# Altium project 243-TGE-Lab1_PCB1_Capteurs.PrjPcb
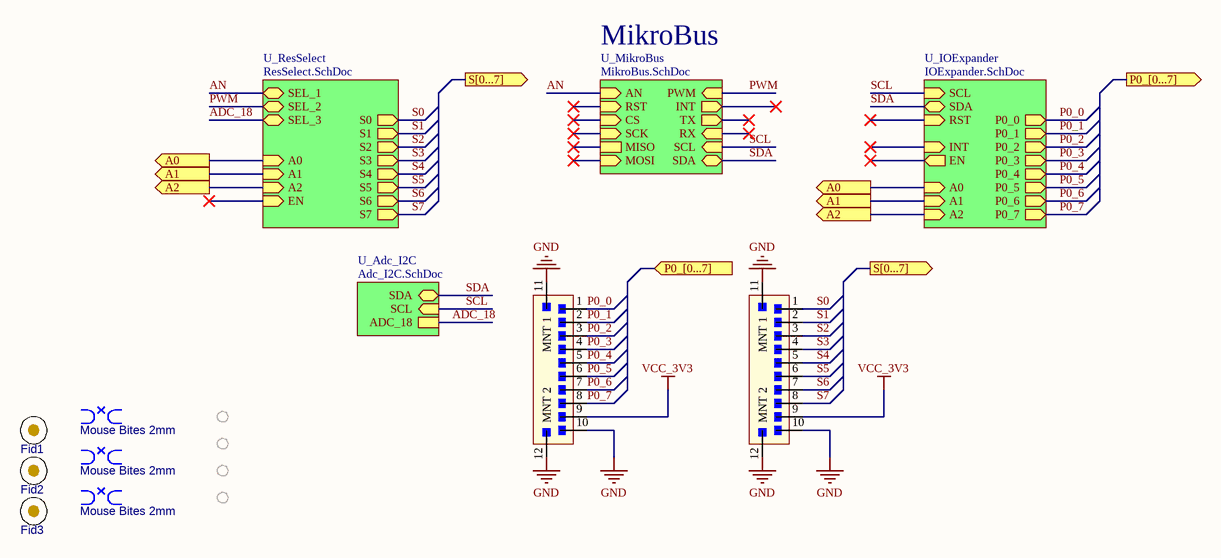
[diagram p0: HeadSheet.SchDoc]
NomDeLetudiant: Le nom de l'étudiant; NomDeProjet: Le nom de mon Projet; Revision: La Revision
5 sheets, 49 parts. Net scope: hierarchical (ports join the sheet entries above them; power ports are global).
Board file: Pcb1.PcbDoc
Sheets:
  HeadSheet.SchDoc
    U_MikroBus = MikroBus.SchDoc
    U_Adc_I2C = Adc_I2C.SchDoc
    U_IOExpander = IOExpander.SchDoc
    U_ResSelect = ResSelect.SchDoc

## Sheet HeadSheet.SchDoc
size Letter; SheetNumber: 1; SheetTotal: 5

### Parts
BRK1  value Mouse Bites 2mm  [BK_CRACK1B_M]  (hidden comment: DNP)  (no BOM)
BRK2  value Mouse Bites 2mm  [BK_CRACK1B_M]  (hidden comment: DNP)  (no BOM)
BRK3  value Mouse Bites 2mm  [BK_CRACK1B_M]  (hidden comment: DNP)  (no BOM)
Fid1  DNP  [FD_Fiducial]  (value not drawn)  (no BOM)
Fid2  DNP  [FD_Fiducial]  (value not drawn)  (no BOM)
Fid3  DNP  [FD_Fiducial]  (value not drawn)  (no BOM)
J1  HC-ZH-10PWT  [J_S10B-ZR-SM4]  (value not drawn)
J2  HC-ZH-10PWT  [J_S10B-ZR-SM4]  (value not drawn)
MH1  DNP  [MP_M-Hole_M2-NonPlated]  (value not drawn)  (no BOM)
MH2  DNP  [MP_M-Hole_M2-NonPlated]  (value not drawn)  (no BOM)
MH3  DNP  [MP_M-Hole_M2-NonPlated]  (value not drawn)  (no BOM)
MH4  DNP  [MP_M-Hole_M2-NonPlated]  (value not drawn)  (no BOM)

### Sub-sheets
U_Adc_I2C = Adc_I2C.SchDoc: ADC_18, SCL (in), SDA (bidir)
U_IOExpander = IOExpander.SchDoc: SCL (in), SDA (bidir), RST (in), P0_0 (out), P0_1 (out), P0_2 (out), P0_3 (out), P0_4 (out), P0_5 (out), P0_6 (out), P0_7 (out), EN (out), INT (in), A0 (in), A1 (in), A2 (in)
U_MikroBus = MikroBus.SchDoc: SDA (bidir), SCL (in), RX (in), TX (out), INT (out), PWM (in), MOSI (in), MISO, SCK (in), CS (in), RST (in), AN (in)
U_ResSelect = ResSelect.SchDoc: EN (in), S0 (out), S1 (out), S2 (out), S3 (out), S4 (out), S5 (out), S6 (out), S7 (out), SEL_1 (bidir), SEL_2 (bidir), SEL_3 (bidir), A0 (in), A1 (in), A2 (in)

### Ports
A0 (out), A1 (out), A2 (out), P0_[0...7] (in), P0_[0...7] (out), S[0...7] (out)

### Nets
GND: J1.10 J1.11(MNT_1) J1.12(MNT_2) J2.10 J2.11(MNT_1) J2.12(MNT_2)
VCC_3V3: J1.9 J2.9
A0: port A0, sheet U_IOExpander/A0, sheet U_ResSelect/A0
A1: port A1, sheet U_IOExpander/A1, sheet U_ResSelect/A1
A2: port A2, sheet U_IOExpander/A2, sheet U_ResSelect/A2
ADC_18: sheet U_Adc_I2C/ADC_18, sheet U_ResSelect/SEL_3
AN: sheet U_MikroBus/AN, sheet U_ResSelect/SEL_1
P0_0: J1.1 ; sheet U_IOExpander/P0_0
P0_1: J1.2 ; sheet U_IOExpander/P0_1
P0_2: J1.3 ; sheet U_IOExpander/P0_2
P0_3: J1.4 ; sheet U_IOExpander/P0_3
P0_4: J1.5 ; sheet U_IOExpander/P0_4
P0_5: J1.6 ; sheet U_IOExpander/P0_5
P0_6: J1.7 ; sheet U_IOExpander/P0_6
P0_7: J1.8 ; sheet U_IOExpander/P0_7
PWM: sheet U_MikroBus/PWM, sheet U_ResSelect/SEL_2
S0: J2.1 ; sheet U_ResSelect/S0
S1: J2.2 ; sheet U_ResSelect/S1
S2: J2.3 ; sheet U_ResSelect/S2
S3: J2.4 ; sheet U_ResSelect/S3
S4: J2.5 ; sheet U_ResSelect/S4
S5: J2.6 ; sheet U_ResSelect/S5
S6: J2.7 ; sheet U_ResSelect/S6
S7: J2.8 ; sheet U_ResSelect/S7
SCL: sheet U_MikroBus/SCL, sheet U_Adc_I2C/SCL, sheet U_IOExpander/SCL
SDA: sheet U_MikroBus/SDA, sheet U_Adc_I2C/SDA, sheet U_IOExpander/SDA

Not connected (* = marked no-connect by the designer): BRK1 1 2 3 4 5; BRK2 1 2 3 4 5; BRK3 1 2 3 4 5; Fid1 1 2 3 4 5; Fid2 1 2 3 4 5; Fid3 1 2 3 4 5

### Notes on the sheet
- MikroBus
- Titre :
- Conception :
- Date :
- Approbation :
- Heure :
- Révision :
- Feuille
- de
- Fichier :

### Library data of the parts
BRK1-BRK3 = BK_BREAKOUT_2MM: Mouse Bites; Mounting Technology: N/A
Fid1-Fid3 = Fiducial: Fiducial mark for alignement and Pick&Place; Value: Fiducial mark; Mounting Technology: N/A
J1 J2 = CONN-1MM5-01X10-S10B-H-SMT: CONN wire to board SMT R/A 10POS 1.5mm; Manufacturer 1: HCTL; Manufacturer Part Number 1: HC-ZH-10PWT; Manufacturer 2: JST; Manufacturer Part Number 2: S10B-ZR-SM4A-TF(LF)(SN); Mounting Technology: SMT; Supplier 1: LCSC; Supplier 2: LCSC; Supplier Part Number 1: C2845432; Supplier Part Number 2: C5149249; Supplier 3: Digikey; Supplier Part Number 3: 455-1700-1-ND
MH1-MH4 = MH-2MM_NP: Mounting Hole 2mm non plated; Manufacturer Part Number 1: DNP; Mounting Technology: N/A; Value: Mounting Hole 2mm non plated; Supplier Part Number 1: N/A

## Sheet MikroBus.SchDoc: Connecteur MikroBus
size Letter; ApprovedBy: Kevin Cotton; Author: Ing. Di Stefano; Organization: Cegep Limoilou; Address1: 1300, 8e Avenue; Address2: Québec, QC; Address3: Canada; Address4: G1J 5L5; Revision: A; SheetNumber: 3; SheetTotal: 5
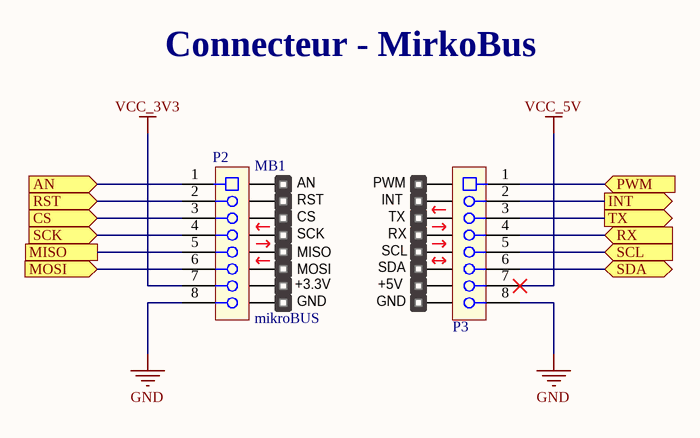
[diagram p1: MikroBus.SchDoc]

### Parts
MB1  mikroBUS  [mikroBUS-Large-No-Connector]  (no BOM)
P2  ESQ-108-14-T-S  [CONN_SKT_01X08_100MIL-ELEVATED-LONGPIN]  (value not drawn)
P3  ESQ-108-14-T-S  [CONN_SKT_01X08_100MIL-ELEVATED-LONGPIN]  (value not drawn)

### Ports
AN (in), CS (in), INT (out), MISO, MOSI (in), PWM (in), RST (in), RX (in), SCK (in), SCL (in), SDA (bidir), TX (out)

### Nets
GND: P2.8 P3.8
VCC_3V3: P2.7
VCC_5V: P3.7
AN: P2.1 ; port AN
CS: P2.3 ; port CS
INT: P3.2 ; port INT
MISO: P2.5 ; port MISO
MOSI: P2.6 ; port MOSI
PWM: P3.1 ; port PWM
RST: P2.2 ; port RST
RX: P3.4 ; port RX
SCK: P2.4 ; port SCK
SCL: P3.5 ; port SCL
SDA: P3.6 ; port SDA
TX: P3.3 ; port TX

Not connected (* = marked no-connect by the designer): MB1 1(AN) 2(RST) 3(CS) 4(SCK) 5(MISO) 6(MOSI) 7(3.3V) 8(GND) 9(GND) 10(5V) 11(SDA) 12(SCL) 13(TX) 14(RX) 15(INT) 16(PWM)

### Notes on the sheet
- Connecteur - MirkoBus
- Titre :
- Conception :
- Date :
- Approbation :
- Heure :
- Révision :
- Feuille
- de
- Fichier :
- (in symbol mikroBUS compatible add-on board) +3.3V; +5V

### Library data of the parts
MB1 = mikroBUS compatible add-on board
P2 P3 = CONN-100MIL-SKT-01X08_ELEVATED_LONGPIN: CONN SOCKET 8pos 100mils Elevated; Manufacturer 1: Samtec; Mounting Technology: TH; Manufacturer Part Number 1: ESQ-108-14-T-S; Supplier 1: Digikey; Supplier Part Number 1: SAM9303-ND

## Sheet Adc_I2C.SchDoc: Circuit ADC I2C
size Letter; ApprovedBy: Kevin Cotton; Author: Ing. Di Stefano; Organization: Cegep Limoilou; Address1: 1300, 8e Avenue; Address2: Québec, QC; Address3: Canada; Address4: G1J 5L5; Revision: A; SheetNumber: 2; SheetTotal: 5
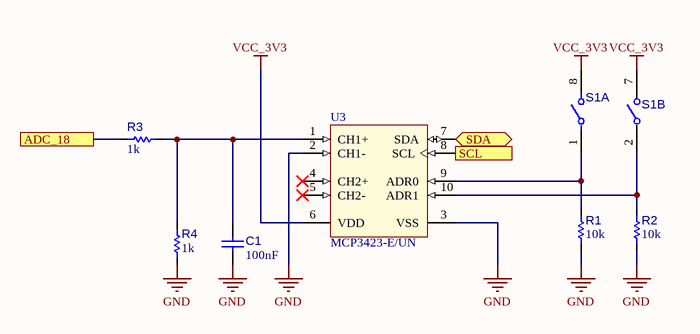
[diagram p2: Adc_I2C.SchDoc]

### Parts
C1  value 100nF  [C_1608[0603]]  (hidden comment: CAP CER 100nF 50V 0603)
R1  value 10k  [R_1608[0603]]  (hidden comment: Res 10k 1% 0603)
R2  value 10k  [R_1608[0603]]  (hidden comment: Res 10k 1% 0603)
R3  value 1k  [R_1608[0603]]  (hidden comment: Res 1k 1% 0603)
R4  value 1k  [R_1608[0603]]  (hidden comment: Res 1k 1% 0603)
S1  DSHP04TSGER  [S_DIP_SWITCH_50MIL_4POS]  (value not drawn)  (parts A,B of 4)
U3  MCP3423-E/UN  [U_MSOP50P300X500-10(RM-10)_WO-TP]

### Ports
ADC_18, SCL (in), SDA (bidir)

### Nets
GND: C1.1 R1.1 R2.1 R4.1 U3.2(CH1-) U3.3(VSS)
VCC_3V3: S1.7 S1.8 U3.6(VDD)
ADC_18: R3.1 ; port ADC_18
SCL: U3.8(SCL) ; port SCL
SDA: U3.7(SDA) ; port SDA
NetC1_2: C1.2 R3.2 R4.2 U3.1(CH1+)
NetR1_2: R1.2 S1.1 U3.9(ADR0)
NetR2_2: R2.2 S1.2 U3.10(ADR1)

Not connected (* = marked no-connect by the designer): U3 4(CH2+)* 5(CH2-)*

### Notes on the sheet
- Titre :
- Conception :
- Date :
- Approbation :
- Heure :
- Révision :
- Feuille
- de
- Fichier :

### Library data of the parts
C1 = CAP002: Capacitor type 1; Manufacturer 1: Yageo; Manufacturer Part Number 1: CC0603KRX7R9BB104; LibRef: CAP002; Code CEGEP: COND0143SM; Tolerance: 10%; Dielectric: X7R; Rated Voltage: 50V; Mounting Technology: SMT; Supplier 1: LCSC; Supplier Part Number 1: C14663
R1 R2 = RES001: Resistor type 1; Manufacturer 1: Yageo; Manufacturer Part Number 1: RC0603FR-0710KL; LibRef: RES001; Code CEGEP: RESI0238-0603; Puissance: 1/10W; Max Working Voltage: 75V; Tolerance: 1%; Mounting Technology: SMT; Supplier 1: LCSC; Supplier Part Number 1: C98220
R3 R4 = RES015: Resistor type 1; Manufacturer 1: Yageo; Manufacturer Part Number 1: RC0603FR-071KL; LibRef: RES015; Puissance: 1/10W; Max Working Voltage: 75V; Tolerance: 1%; Mounting Technology: SMT; Supplier 1: LCSC; Supplier Part Number 1: C22548
S1 = SW_DIP_50MIL_4POS: SWITCH DIP SLIDE SPST 25MA 24V, pitch 1.27mm, height 1.55mm; Manufacturer 1: kangshen; Value: DIP Switch 4pos; Manufacturer 2: Omron; Manufacturer Part Number 1: DSHP04TSGER; Manufacturer Part Number 2: A6H-4102-PM; Mounting Technology: SMT; Supplier 1: LCSC; Supplier 2: LCSC; Supplier Part Number 1: C3293144; Supplier Part Number 2: C2733274; Supplier 3: Digikey; Supplier Part Number 3: 39-A6H-4102-PMCT-ND
U3 = U_MCP3423-E/UN: CAN Controller Stand-Alone With SPI, 18-Pin PDIP; Manufacturer 1: Microchip; Manufacturer Part Number 1: MCP3423-E/UN; Supplier 1: LCSC; Supplier Part Number 1: C220864; Mounting Technology: SMT; Supplier 2: Digikey; Supplier Part Number 2: MCP3423-E/UN-ND

## Sheet IOExpander.SchDoc: I/O Expander
size Letter; ApprovedBy: Kevin Cotton; Author: Jessica Di Stefano; Organization: Cegep Limoilou; Address1: 1300, 8e Avenue; Address2: Québec, QC; Address3: Canada; Address4: G1J 5L5; SheetNumber: 5; SheetTotal: 5
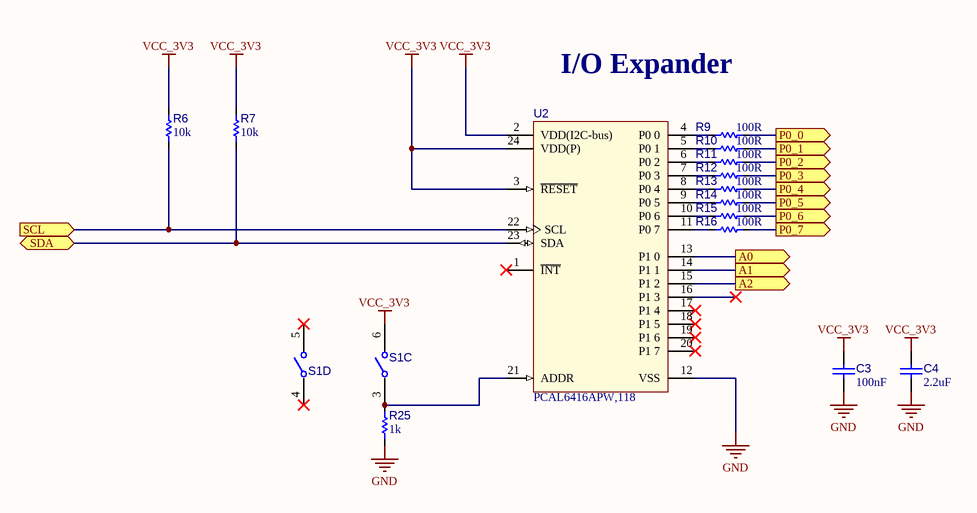
[diagram p3: IOExpander.SchDoc]

### Parts
C3  value 100nF  [C_1608[0603]]  (hidden comment: CAP CER 100nF 50V 0603)
C4  value 2.2uF  [C_1608[0603]]  (hidden comment: CAP CER 2.2uF 10V X7R 0603)
R6  value 10k  [R_1608[0603]]  (hidden comment: Res 10k 1% 0603)
R7  value 10k  [R_1608[0603]]  (hidden comment: Res 10k 1% 0603)
R9  value 100R  [R_1608[0603]]  (hidden comment: Res 100R 1% 0603)
R10  value 100R  [R_1608[0603]]  (hidden comment: Res 100R 1% 0603)
R11  value 100R  [R_1608[0603]]  (hidden comment: Res 100R 1% 0603)
R12  value 100R  [R_1608[0603]]  (hidden comment: Res 100R 1% 0603)
R13  value 100R  [R_1608[0603]]  (hidden comment: Res 100R 1% 0603)
R14  value 100R  [R_1608[0603]]  (hidden comment: Res 100R 1% 0603)
R15  value 100R  [R_1608[0603]]  (hidden comment: Res 100R 1% 0603)
R16  value 100R  [R_1608[0603]]  (hidden comment: Res 100R 1% 0603)
R25  value 1k  [R_1608[0603]]  (hidden comment: Res 1k 1% 0603)
S1  DSHP04TSGER  [S_DIP_SWITCH_50MIL_4POS]  (value not drawn)  (parts C,D of 4)
U2  PCAL6416APW,118  [U_TSSOP24_SOT355-1-IPC_B]

### Ports
A0 (out), A1 (out), A2 (out), P0_0 (out), P0_1 (out), P0_2 (out), P0_3 (out), P0_4 (out), P0_5 (out), P0_6 (out), P0_7 (out), SCL (in), SDA (bidir)

### Nets
GND: C3.1 C4.1 R25.1 U2.12(VSS)
VCC_3V3: C3.2 C4.2 R6.2 R7.2 S1.6 U2.2(VDD(I2C-bus)) U2.3(~{RESET}) U2.24(VDD(P))
A0: U2.13(P1_0) ; port A0
A1: U2.14(P1_1) ; port A1
A2: U2.15(P1_2) ; port A2
P0_0: R9.2 ; port P0_0
P0_1: R10.2 ; port P0_1
P0_2: R11.2 ; port P0_2
P0_3: R12.2 ; port P0_3
P0_4: R13.2 ; port P0_4
P0_5: R14.2 ; port P0_5
P0_6: R15.2 ; port P0_6
P0_7: R16.2 ; port P0_7
SCL: R6.1 U2.22(SCL) ; port SCL
SDA: R7.1 U2.23(SDA) ; port SDA
NetR9_1: R9.1 U2.4(P0_0)
NetR10_1: R10.1 U2.5(P0_1)
NetR11_1: R11.1 U2.6(P0_2)
NetR12_1: R12.1 U2.7(P0_3)
NetR13_1: R13.1 U2.8(P0_4)
NetR14_1: R14.1 U2.9(P0_5)
NetR15_1: R15.1 U2.10(P0_6)
NetR16_1: R16.1 U2.11(P0_7)
NetR25_2: R25.2 S1.3 U2.21(ADDR)

Not connected (* = marked no-connect by the designer): S1 4* 5*; U2 1(~{INT})* 16(P1_3)* 17(P1_4)* 18(P1_5)* 19(P1_6)* 20(P1_7)*

### Notes on the sheet
- I/O Expander
- Titre :
- Conception :
- Date :
- Approbation :
- Heure :
- Révision :
- Feuille
- de
- Fichier :

### Library data of the parts
C3 = CAP002: as C1 on sheet Adc_I2C; Rated Voltage: 50V; Mounting Technology: SMT; Supplier 1: LCSC; Supplier Part Number 1: C14663
C4 = CAP022: Capacitor type 1; Manufacturer 1: Samsung; Manufacturer Part Number 1: CL10B225KP8NNNC; LibRef: CAP022; Tolerance: 10%; Rated Voltage: 10V; Dielectric: X7R; Mounting Technology: SMT; Supplier 1: LCSC; Supplier Part Number 1: C100082
R6 R7 = RES001: as R1 on sheet Adc_I2C; Tolerance: 1%; Mounting Technology: SMT; Supplier 1: LCSC; Supplier Part Number 1: C98220
R9-R16 = RES029: Resistor type 1; Manufacturer 1: Yageo; Manufacturer Part Number 1: RC0603FR-07100RL; LibRef: RES029; Puissance: 1/10W; Max Working Voltage: 75V; Tolerance: 1%; Mounting Technology: SMT; Supplier 1: LCSC; Supplier Part Number 1: C105588
R25 = RES015: as R3 on sheet Adc_I2C; Tolerance: 1%; Mounting Technology: SMT; Supplier 1: LCSC; Supplier Part Number 1: C22548
S1 = SW_DIP_50MIL_4POS: as S1 on sheet Adc_I2C; Manufacturer 2: Omron; Manufacturer Part Number 1: DSHP04TSGER; Manufacturer Part Number 2: A6H-4102-PM; Mounting Technology: SMT; Supplier 1: LCSC; Supplier 2: LCSC; Supplier Part Number 1: C3293144; Supplier Part Number 2: C2733274; Supplier 3: Digikey; Supplier Part Number 3: 39-A6H-4102-PMCT-ND
U2 = U_PCAL6416APW: IC I/O EXPANDER 16BIT 24TSSOP; Manufacturer Part Number 1: TCA6416APWR; Manufacturer 1: Texas Instruments; Manufacturer 2: NXP Semiconductors; Manufacturer Part Number 2: PCAL6416APW,118; Mounting Technology: SMT; Supplier 1: LCSC; Supplier 2: LCSC; Supplier 3: Digikey; Supplier Part Number 1: C130203; Supplier Part Number 2: C2652299; Supplier Part Number 3: 568-9922-1-ND

## Sheet ResSelect.SchDoc: TITRE
size Letter; ApprovedBy: APPROUVÉ PAR; Author: Le nom de l'étudiant; Organization: Cegep Limoilou; Address1: 1300, 8e Avenue; Address2: Québec, QC; Address3: Canada; Address4: G1J 5L5; SheetNumber: 4; SheetTotal: 5
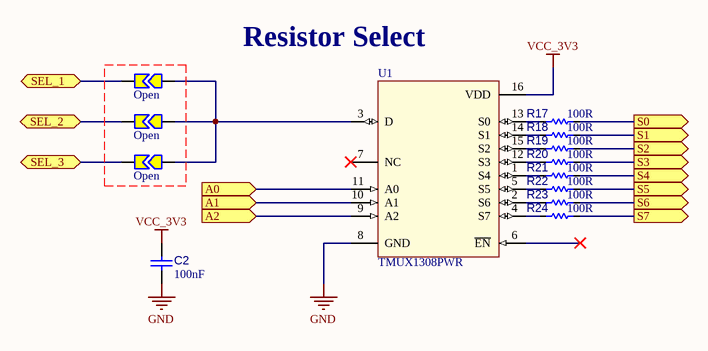
[diagram p4: ResSelect.SchDoc]

### Parts
C2  value 100nF  [C_1608[0603]]  (hidden comment: CAP CER 100nF 50V 0603)
R17  value 100R  [R_1608[0603]]  (hidden comment: Res 100R 1% 0603)
R18  value 100R  [R_1608[0603]]  (hidden comment: Res 100R 1% 0603)
R19  value 100R  [R_1608[0603]]  (hidden comment: Res 100R 1% 0603)
R20  value 100R  [R_1608[0603]]  (hidden comment: Res 100R 1% 0603)
R21  value 100R  [R_1608[0603]]  (hidden comment: Res 100R 1% 0603)
R22  value 100R  [R_1608[0603]]  (hidden comment: Res 100R 1% 0603)
R23  value 100R  [R_1608[0603]]  (hidden comment: Res 100R 1% 0603)
R24  value 100R  [R_1608[0603]]  (hidden comment: Res 100R 1% 0603)
SB1  Open  [SB-TINY-OPEN]  (no BOM)
SB2  Open  [SB-TINY-OPEN]  (no BOM)
SB3  Open  [SB-TINY-OPEN]  (no BOM)
U1  TMUX1308PWR  [U_TSSOP65P500X450-16]

### Ports
A0 (in), A1 (in), A2 (in), S0 (out), S1 (out), S2 (out), S3 (out), S4 (out), S5 (out), S6 (out), S7 (out), SEL_1 (bidir), SEL_2 (bidir), SEL_3 (bidir)

### Nets
GND: C2.1 U1.8(GND)
VCC_3V3: C2.2 U1.16(VDD)
A0: U1.11(A0) ; port A0
A1: U1.10(A1) ; port A1
A2: U1.9(A2) ; port A2
ADC_18: SB3.2 ; port SEL_3
AN: SB1.2 ; port SEL_1
PWM: SB2.2 ; port SEL_2
S0: R17.2 ; port S0
S1: R18.2 ; port S1
S2: R19.2 ; port S2
S3: R20.2 ; port S3
S4: R21.2 ; port S4
S5: R22.2 ; port S5
S6: R23.2 ; port S6
S7: R24.2 ; port S7
NetR17_1: R17.1 U1.13(S0)
NetR18_1: R18.1 U1.14(S1)
NetR19_1: R19.1 U1.15(S2)
NetR20_1: R20.1 U1.12(S3)
NetR21_1: R21.1 U1.1(S4)
NetR22_1: R22.1 U1.5(S5)
NetR23_1: R23.1 U1.2(S6)
NetR24_1: R24.1 U1.4(S7)
NetSB1_1: SB1.1 SB2.1 SB3.1 U1.3(D)

Not connected (* = marked no-connect by the designer): U1 6(~{EN})* 7(NC)*

### Notes on the sheet
- (near U1) Resistor Select
- Titre :
- Conception :
- Date :
- Approbation :
- Heure :
- Révision :
- Feuille
- de
- Fichier :

### Library data of the parts
C2 = CAP002: as C1 on sheet Adc_I2C; Rated Voltage: 50V; Mounting Technology: SMT; Supplier 1: LCSC; Supplier Part Number 1: C14663
R17-R24 = RES029: as R9 on sheet IOExpander; Tolerance: 1%; Mounting Technology: SMT; Supplier 1: LCSC; Supplier Part Number 1: C105588
SB1-SB3 = Solder-Jumper-Open: Solder Jumper
U1 = U_TMUX1308PWR: IC MUX 8:1 195OHM 16TSSOP; Manufacturer 1: TI; Manufacturer Part Number 1: TMUX1308PWR; Mounting Technology: SMT; Supplier 1: LCSC; Supplier 2: Digikey; Supplier Part Number 1: C970231; Supplier Part Number 2: 296-TMUX1308PWRCT-ND

## Nets that join several sheets
GND: HeadSheet (6 pins), MikroBus (P2.8 P3.8), Adc_I2C (6 pins), IOExpander (C3.1 C4.1 R25.1 U2.12), ResSelect (C2.1 U1.8)
VCC_3V3: HeadSheet (J1.9 J2.9), MikroBus (P2.7), Adc_I2C (S1.7 S1.8 U3.6), IOExpander (8 pins), ResSelect (C2.2 U1.16)
A0: IOExpander (U2.13), ResSelect (U1.11)
A1: IOExpander (U2.14), ResSelect (U1.10)
A2: IOExpander (U2.15), ResSelect (U1.9)
ADC_18: Adc_I2C (R3.1), ResSelect (SB3.2)
AN: MikroBus (P2.1), ResSelect (SB1.2)
P0_0: HeadSheet (J1.1), IOExpander (R9.2)
P0_1: HeadSheet (J1.2), IOExpander (R10.2)
P0_2: HeadSheet (J1.3), IOExpander (R11.2)
P0_3: HeadSheet (J1.4), IOExpander (R12.2)
P0_4: HeadSheet (J1.5), IOExpander (R13.2)
P0_5: HeadSheet (J1.6), IOExpander (R14.2)
P0_6: HeadSheet (J1.7), IOExpander (R15.2)
P0_7: HeadSheet (J1.8), IOExpander (R16.2)
PWM: MikroBus (P3.1), ResSelect (SB2.2)
S0: HeadSheet (J2.1), ResSelect (R17.2)
S1: HeadSheet (J2.2), ResSelect (R18.2)
S2: HeadSheet (J2.3), ResSelect (R19.2)
S3: HeadSheet (J2.4), ResSelect (R20.2)
S4: HeadSheet (J2.5), ResSelect (R21.2)
S5: HeadSheet (J2.6), ResSelect (R22.2)
S6: HeadSheet (J2.7), ResSelect (R23.2)
S7: HeadSheet (J2.8), ResSelect (R24.2)
SCL: MikroBus (P3.5), Adc_I2C (U3.8), IOExpander (R6.1 U2.22)
SDA: MikroBus (P3.6), Adc_I2C (U3.7), IOExpander (R7.1 U2.23)